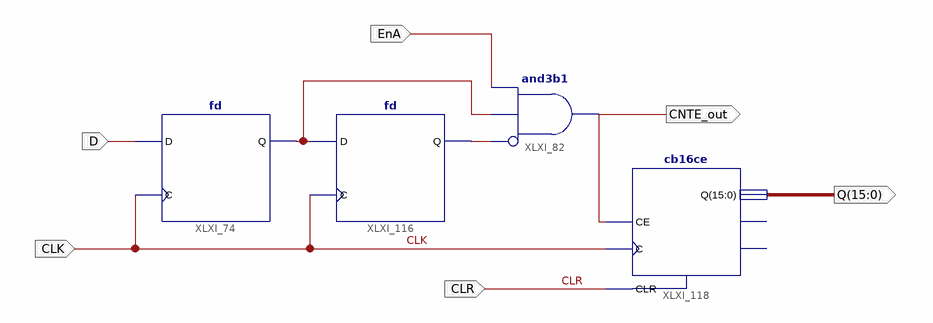
[diagram p0: schematic sheet 1]
// Xilinx ISE schematic pulse_count.sch (spartan6) as structural Verilog: 4 symbols, 6 ports
module pulse_count (
  input  CLR,
  input  CLK,
  input  D,
  input  EnA,
  output CNTE_out,
  output [15:0] Q
);

  wire XLXN_343, XLXN_344;

  fd XLXI_74 (.C(CLK), .D(D), .Q(XLXN_343));
  fd XLXI_116 (.C(CLK), .D(XLXN_343), .Q(XLXN_344));
  and XLXI_82 (CNTE_out, ~XLXN_344, XLXN_343, EnA);  // and3b1
  cb16ce XLXI_118 (.C(CLK), .CE(CNTE_out), .CLR(CLR), .Q(Q));  // open: CEO, TC
endmodule
